# Altium schematic sheet USB.SchDoc
size A; SheetNumber: 2; SheetTotal: 3
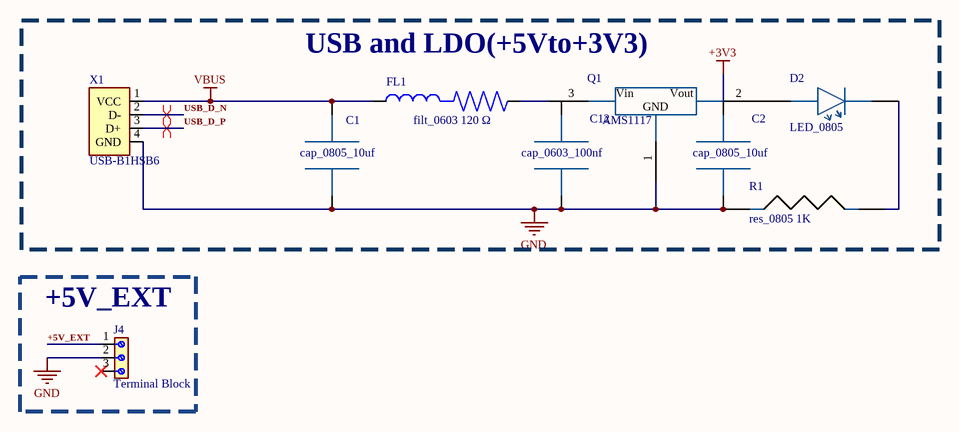
[diagram p0: USB.SchDoc]

## Parts
C1  cap_0805_10uf  [capa0805]
C2  cap_0805_10uf  [capa0805]
C12  cap_0603_100nf  [capa0805]
D2  LED_0805  [LED_0805]
FL1  filt_0603 120 Ω  [BEADC1608X95N]
J4  Terminal Block  [691216710003]
Q1  AMS1117  [AMS1117]
R1  res_0805 1K  [Res_0805]
X1  USB-B1HSB6  [USB-B1HSB6]

## Blocks framed on the sheet
USB and LDO(+5Vto+3V3): C1 C2 C12 D2 FL1 Q1 R1 X1
+5V_EXT: J4

## Nets
+3V3: C2.2
GND: C1.1 C2.1 C12.1 J4.2 Q1.1 R1.1 X1.4(GND)
VBUS: C1.2 FL1.1 X1.1(VCC)
+5V_EXT: J4.1
USB_D_N: X1.2(D-)
USB_D_P: X1.3(D+)
NetD2_1: D2.1 Q1.2
NetD2_2: D2.2 R1.2
NetFL1_2: FL1.2 Q1.3

Not connected (* = marked no-connect by the designer): C12 2; J4 3*

## Layout directives
differential pair: USB_D_N, USB_D_P

## Notes on the sheet
- (in symbol AMS1117) Vin; Vout; GND

## Library data of the parts
C1 C2 = cap_0805_10uf: MFR: Samsung Electro-Mechanics; MFR part: CL21A106KAYNNNE; supplier: lcsc; supplier part: C15850; ComponentLink1Description: buy; ComponentLink1URL: https://www.lcsc.com/product-detail/C15850.html?spm=wm.fly.bg.2.xh___wm.fly.tp.3.ml&lcsc_vid=EQMKBQFTFldaAV0ERFFdUwBeRAQMVV0CRgdWAlFeEVExVlNeQFBaV1xRQ1ZbUjsOAxUeFF5JWBYZEEoBGA4JCwFIFA4DSA%3D%3D
C12 = cap_0603_100nf: MFR: Samsung Electro-Mechanics; MFR part: CL10B104KB8NNNC; supplier: lcsc; supplier part: C1591; ComponentLink1Description: buy; ComponentLink1URL: https://www.lcsc.com/product-detail/C1591.html?s_z=n_q_t_Capacitors%2520100nf&spm=wm.fly.bg.0.xh___wm.ssy.tc.0.tz&lcsc_vid=EQJbUwEATwBfUlMDRFFfBlZSEVNfAV1WQFgPU1dQRAIxVlNeTlBZVFNTQFlWVTsOAxUeFF5JWBYZEEoKFBINSQcJGk4dAgUUFAk%3D
D2 = LED_0805: MFR: YONGYUTAI; MFR part: YLED0805R; supplier: lcsc; supplier part: C19171391; ComponentLink1Description: buy; ComponentLink1URL: https://www.lcsc.com/product-detail/C19171391.html?s_z=n_q_t_LED%25200805&spm=wm.fly.bg.0.xh___wm.ssy.tc.0.tz&lcsc_vid=EQMKBQFTFldaAV0ERFFdUwBeRAQMVV0CRgdWAlFeEVExVlNeQFVbXl1XRlJdUTsOAxUeFF5JWBYZEEoKFBINSQcJGk4eFQsCAgIaSgADAwAHC0slRVlaVFxWTk8GEwkK
FL1 = filt_0603: MFR: muRata; MFR part: BLM18EG121SH1D; supplier: lcsc; supplier part: C160979; ComponentLink1Description: buy; ComponentLink1URL: https://www.lcsc.com/product-detail/C160979.html?s_z=n_q_BLM18EG121SH1D&spm=wm.fly.bg.0.xh&lcsc_vid=EQMKBQFTFldaAV0ERFFdUwBeRAQMVV0CRgdWAlFeEVExVlNeQFlfVVFQT1VbVzsOAxUeFF5JWBYZEEoKFBINSQcJGk4eFQsCAgIaSgADAwAHC0slQFJfU1BeTk8GEwkK
J4 = Terminal Block: MFR: MAX; MFR part: MX126-5.0-02P-GN01-Cu-S-A; supplier: lcsc; supplier part: C5188434; ComponentLink1Description: buy; ComponentLink1URL: https://www.lcsc.com/product-detail/C5188434.html?s_z=n_q_t_Terminal%2520Block%2520&spm=wm.fly.bg.17.xh___wm.ssy.tc.0.tz&lcsc_vid=EQJbUwEATwBfUlMDRFFfBlZSEVNfAV1WQFgPU1dQRAIxVlNeTlNfXl1VQVZfXzsOAxUeFF5JWBYZEEoKFBINSQcJGk4dAgUUFAk%3D
Q1 = AMS1117: MFR: Advanced Monolithic Systems; MFR part: AMS1117-3.3; supplier: lcsc; supplier part: C6186; ComponentLink1Description: buy; ComponentLink1URL: https://www.lcsc.com/product-detail/C6186.html?s_z=n_q_Advanced%2520Monolithic%2520Systems%2520AMS1117-3.3&spm=wm.fly.bg.0.xh&lcsc_vid=EQMKBQFTFldaAV0ERFFdUwBeRAQMVV0CRgdWAlFeEVExVlNeQFlfU1NQQlNZXzsOAxUeFF5JWBYZEEoKFBINSQcJGk4eFQsCAgIaSgADAwAHC0slQVBWUEoOAwwC
R1 = res_0805: MFR: FOJAN; MFR part: FRC0805F1001TS; supplier: lcsc; supplier part: C2907232; ComponentLink1Description: buy; ComponentLink1URL: https://www.lcsc.com/product-detail/C2907232.html?s_z=n_q_t_0805%25201K%2520resistor&spm=wm.fly.bg.0.xh___wm.ssy.tc.0.tz&lcsc_vid=EQMKBQFTFldaAV0ERFFdUwBeRAQMVV0CRgdWAlFeEVExVlNeQFVbU1VVRVNeUDsOAxUeFF5JWBYZEEoKFBINSQcJGk4%3D
X1 = USB-B1HSB6: MFR: On-Shore Tech; ComponentLink1Description: buy; ComponentLink1URL: https://www.lcsc.com/product-detail/C3197678.html?s_z=n_q_USB-B1HSB6&spm=wm.fly.bg.0.xh&lcsc_vid=EQMKBQFTFldaAV0ERFFdUwBeRAQMVV0CRgdWAlFeEVExVlNeQFRYX1ZXT1ddUjsOAxUeFF5JWBYZEEoKFBINSQcJGk4eFQsCAgIaSgADAwAHC0slQldcXlReQ08GEwkK; MFR part: USB-B1HSB6; supplier: lcsc; supplier part: C3197678